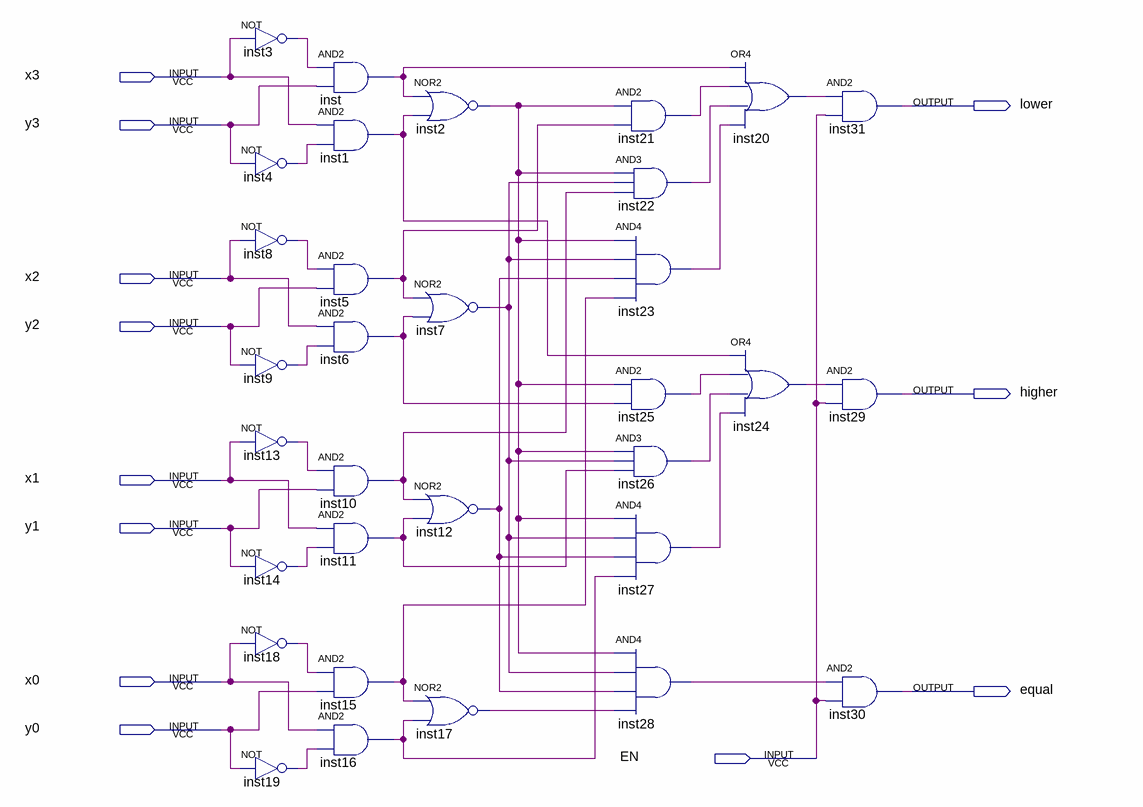
[diagram p0: schematic sheet]
// Quartus schematic Lab1.bdf as structural Verilog: 32 symbols, 12 pins
module Lab1 (
  input  x3,
  input  y3,
  input  x2,
  input  y2,
  input  x1,
  input  y1,
  input  x0,
  input  y0,
  input  EN,
  output lower,
  output higher,
  output equal
);

  wire inst1_out, inst2_out, inst3_out, inst4_out, inst5_out, inst6_out, inst7_out, inst8_out, inst9_out,
       inst10_out, inst11_out, inst12_out, inst13_out, inst14_out, inst15_out, inst16_out, inst17_out,
       inst18_out, inst19_out, inst20_out, inst21_out, inst22_out, inst23_out, inst24_out, inst25_out,
       inst26_out, inst27_out, inst28_out, inst_out;

  not inst3 (inst3_out, x3);
  not inst4 (inst4_out, y3);
  not inst8 (inst8_out, x2);
  not inst9 (inst9_out, y2);
  not inst13 (inst13_out, x1);
  not inst14 (inst14_out, y1);
  not inst18 (inst18_out, x0);
  not inst19 (inst19_out, y0);
  and inst (inst_out, inst3_out, y3);
  and inst1 (inst1_out, x3, inst4_out);
  and inst5 (inst5_out, inst8_out, y2);
  and inst6 (inst6_out, x2, inst9_out);
  and inst10 (inst10_out, inst13_out, y1);
  and inst11 (inst11_out, x1, inst14_out);
  and inst15 (inst15_out, inst18_out, y0);
  and inst16 (inst16_out, x0, inst19_out);
  nor inst2 (inst2_out, inst_out, inst1_out);
  nor inst7 (inst7_out, inst5_out, inst6_out);
  nor inst12 (inst12_out, inst10_out, inst11_out);
  nor inst17 (inst17_out, inst15_out, inst16_out);
  and inst21 (inst21_out, inst2_out, inst5_out);
  and inst22 (inst22_out, inst2_out, inst7_out, inst10_out);
  and inst23 (inst23_out, inst2_out, inst7_out, inst12_out, inst15_out);
  and inst25 (inst25_out, inst2_out, inst6_out);
  and inst26 (inst26_out, inst2_out, inst7_out, inst11_out);
  and inst27 (inst27_out, inst2_out, inst7_out, inst12_out, inst16_out);
  and inst28 (inst28_out, inst2_out, inst7_out, inst12_out, inst17_out);
  or inst20 (inst20_out, inst_out, inst21_out, inst22_out, inst23_out);
  or inst24 (inst24_out, inst1_out, inst25_out, inst26_out, inst27_out);
  and inst31 (lower, inst20_out, EN);
  and inst29 (higher, inst24_out, EN);
  and inst30 (equal, inst28_out, EN);
endmodule
